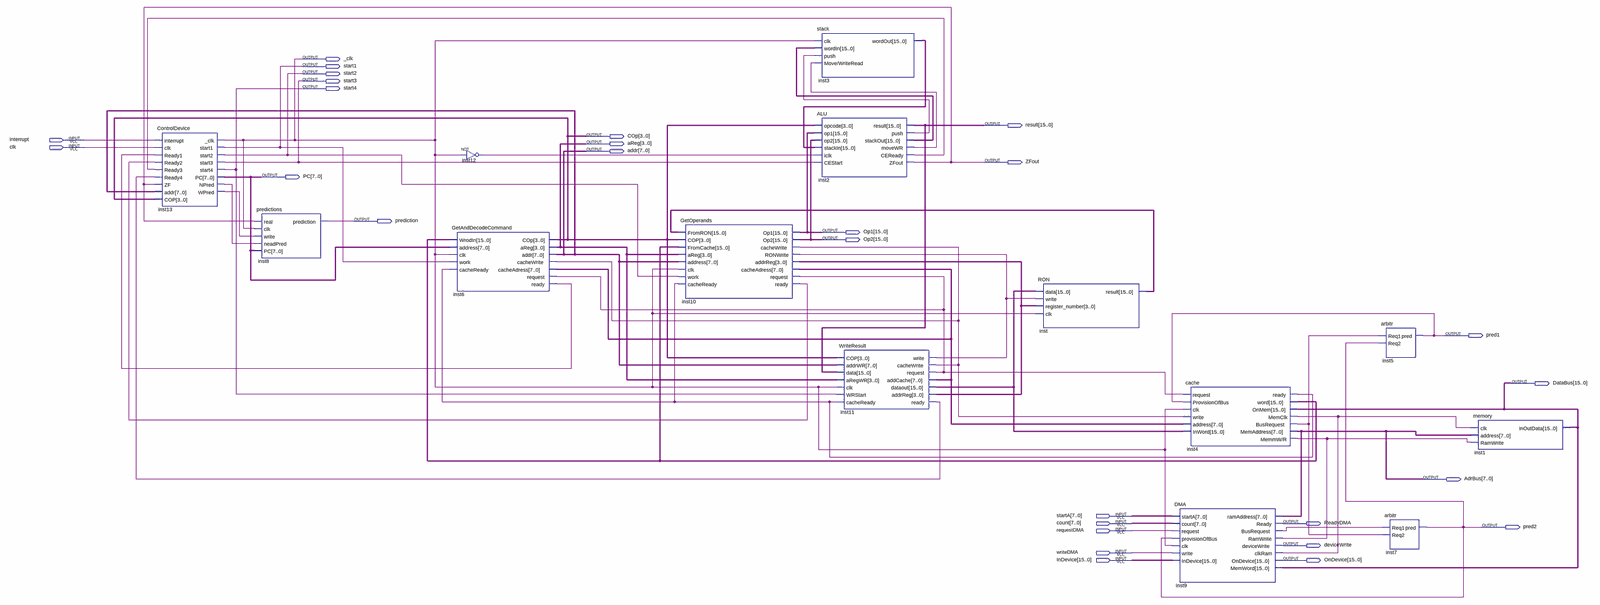
[diagram p0: schematic sheet, whole]
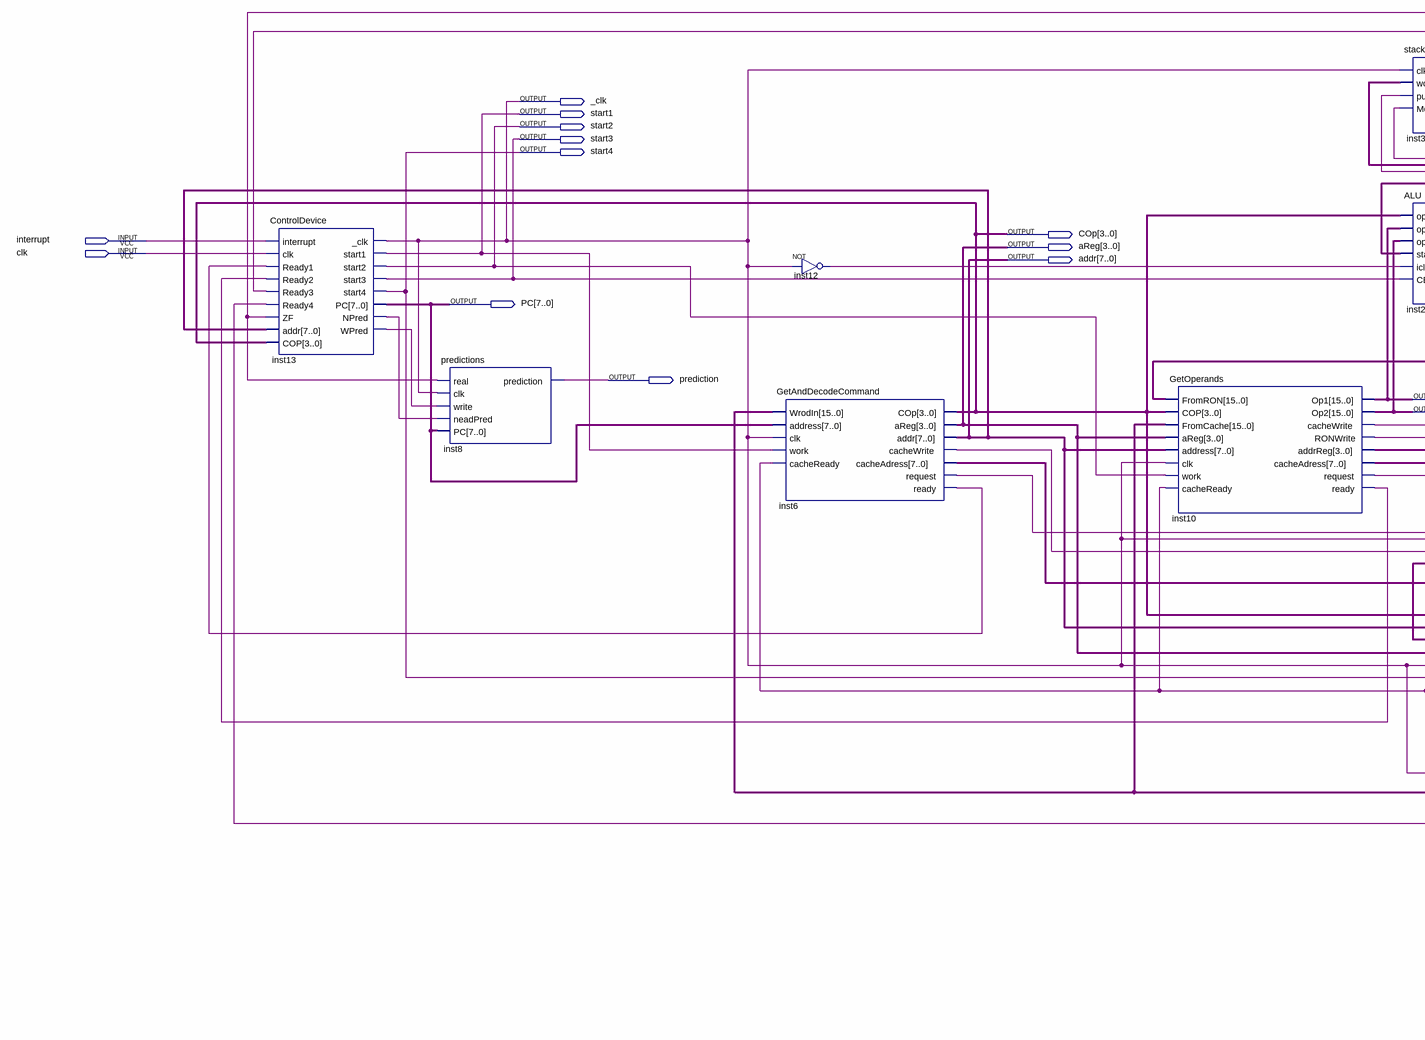
[diagram p1: schematic sheet, left part]
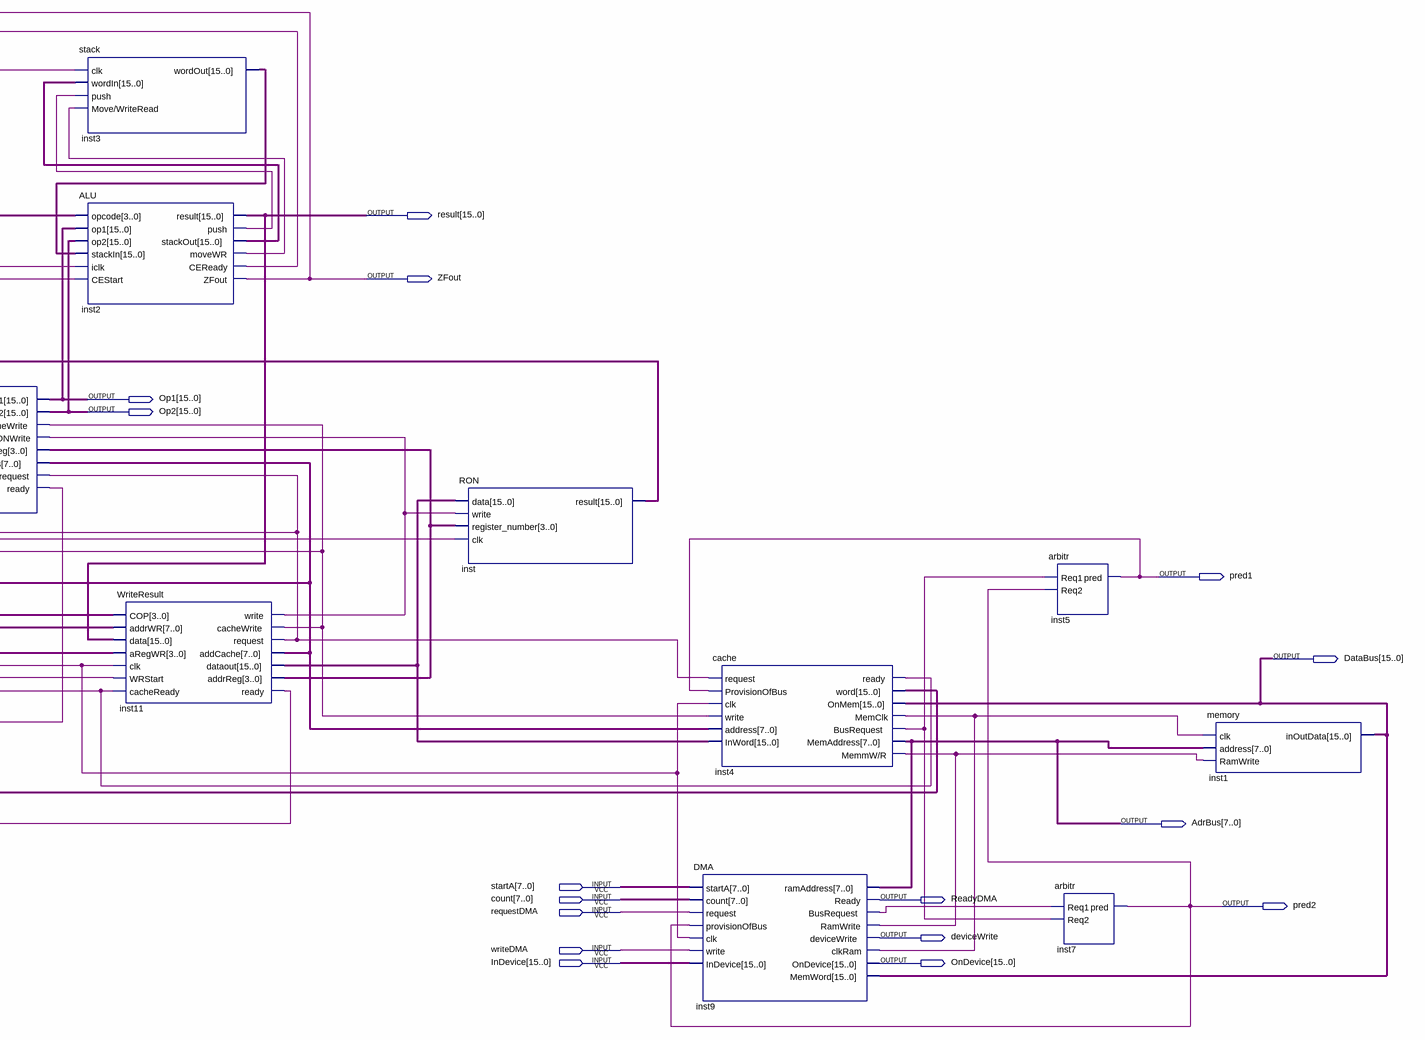
[diagram p2: schematic sheet, right part]
// Quartus schematic cpu-evm.bdf as structural Verilog: 14 symbols, 28 pins
module \cpu-evm  (
  input  interrupt,
  input  clk,
  input  [7:0] startA,
  input  [7:0] count,
  input  requestDMA,
  input  writeDMA,
  input  [15:0] InDevice,
  output _clk,
  output start1,
  output start2,
  output start3,
  output start4,
  output [15:0] result,
  output [3:0] COp,
  output [3:0] aReg,
  output [7:0] addr,
  output ZFout,
  output [7:0] PC,
  output prediction,
  output [15:0] Op1,
  output [15:0] Op2,
  output pred1,
  output [15:0] DataBus,
  output [7:0] AdrBus,
  output ReadyDMA,
  output pred2,
  output deviceWrite,
  output [15:0] OnDevice
);

  wire inst2_ceready, inst2_movewr, inst2_push, inst4_busrequest, inst4_ready, inst6_cachewrite, inst6_ready,
       inst6_request, inst9_busrequest, inst9_clkram, inst9_ramwrite, inst10_ready, inst10_ronwrite,
       inst11_ready, inst12_out, inst13_npred, inst13_wpred;
  wire [3:0] inst10_addrreg;
  wire [7:0] inst6_cacheadress;
  wire [15:0] inst2_stackout, inst3_wordout, inst4_word, inst11_dataout, inst_result;

  ControlDevice inst13 (
    .interrupt(interrupt), .clk(clk), .Ready1(inst6_ready), .Ready2(inst10_ready), .Ready3(inst2_ceready),
    .Ready4(inst11_ready), .ZF(ZFout), .addr(addr), .COP(COp), ._clk(_clk), .start1(start1), .start2(start2),
    .start3(start3), .start4(start4), .PC(PC), .NPred(inst13_npred), .WPred(inst13_wpred));
  predictions inst8 (
    .\real (ZFout), .clk(_clk), .write(inst13_wpred), .neadPred(inst13_npred), .PC(PC),
    .prediction(prediction));
  not inst12 (inst12_out, _clk);
  GetAndDecodeCommand inst6 (
    .WrodIn(inst4_word), .address(PC), .clk(_clk), .work(start1), .cacheReady(inst4_ready), .COp(COp),
    .aReg(aReg), .addr(addr), .cacheWrite(inst6_cachewrite), .cacheAdress(inst6_cacheadress),
    .request(inst6_request), .ready(inst6_ready));
  GetOperands inst10 (
    .FromRON(inst_result), .COP(COp), .FromCache(inst4_word), .aReg(aReg), .address(addr), .clk(_clk),
    .work(start2), .cacheReady(inst4_ready), .Op1(Op1), .Op2(Op2), .cacheWrite(inst6_cachewrite),
    .RONWrite(inst10_ronwrite), .addrReg(inst10_addrreg), .cacheAdress(inst6_cacheadress),
    .request(inst6_request), .ready(inst10_ready));
  stack inst3 (
    .clk(_clk), .wordIn(inst2_stackout), .push(inst2_push), .\Move/WriteRead (inst2_movewr),
    .wordOut(inst3_wordout));
  ALU inst2 (
    .opcode(COp), .op1(Op1), .op2(Op2), .stackIn(inst3_wordout), .iclk(inst12_out), .CEStart(start3),
    .result(result), .push(inst2_push), .stackOut(inst2_stackout), .moveWR(inst2_movewr),
    .CEReady(inst2_ceready), .ZFout(ZFout));
  WriteResult inst11 (
    .COP(COp), .addrWR(addr), .data(result), .aRegWR(aReg), .clk(_clk), .WRStart(start4),
    .cacheReady(inst4_ready), .write(inst10_ronwrite), .cacheWrite(inst6_cachewrite),
    .request(inst6_request), .addCache(inst6_cacheadress), .dataout(inst11_dataout),
    .addrReg(inst10_addrreg), .ready(inst11_ready));
  RON inst (
    .data(inst11_dataout), .write(inst10_ronwrite), .register_number(inst10_addrreg), .clk(_clk),
    .result(inst_result));
  DMA inst9 (
    .startA(startA), .count(count), .request(requestDMA), .provisionOfBus(pred2), .clk(_clk),
    .write(writeDMA), .InDevice(InDevice), .ramAddress(AdrBus), .Ready(ReadyDMA),
    .BusRequest(inst9_busrequest), .RamWrite(inst9_ramwrite), .deviceWrite(deviceWrite),
    .clkRam(inst9_clkram), .OnDevice(OnDevice), .MemWord(DataBus));
  cache inst4 (
    .request(inst6_request), .ProvisionOfBus(pred1), .clk(_clk), .write(inst6_cachewrite),
    .address(inst6_cacheadress), .InWord(inst11_dataout), .ready(inst4_ready), .word(inst4_word),
    .MemClk(inst9_clkram), .BusRequest(inst4_busrequest), .MemAddress(AdrBus), .\MemmW/R (inst9_ramwrite),
    .OnMem(DataBus));
  arbitr inst5 (.Req1(inst4_busrequest), .Req2(pred2), .pred(pred1));
  arbitr inst7 (.Req1(inst9_busrequest), .Req2(inst4_busrequest), .pred(pred2));
  memory inst1 (.clk(inst9_clkram), .address(AdrBus), .RamWrite(inst9_ramwrite), .inOutData(DataBus));
endmodule
